# EAGLE design pcbCard (EAGLE 7.4.0)
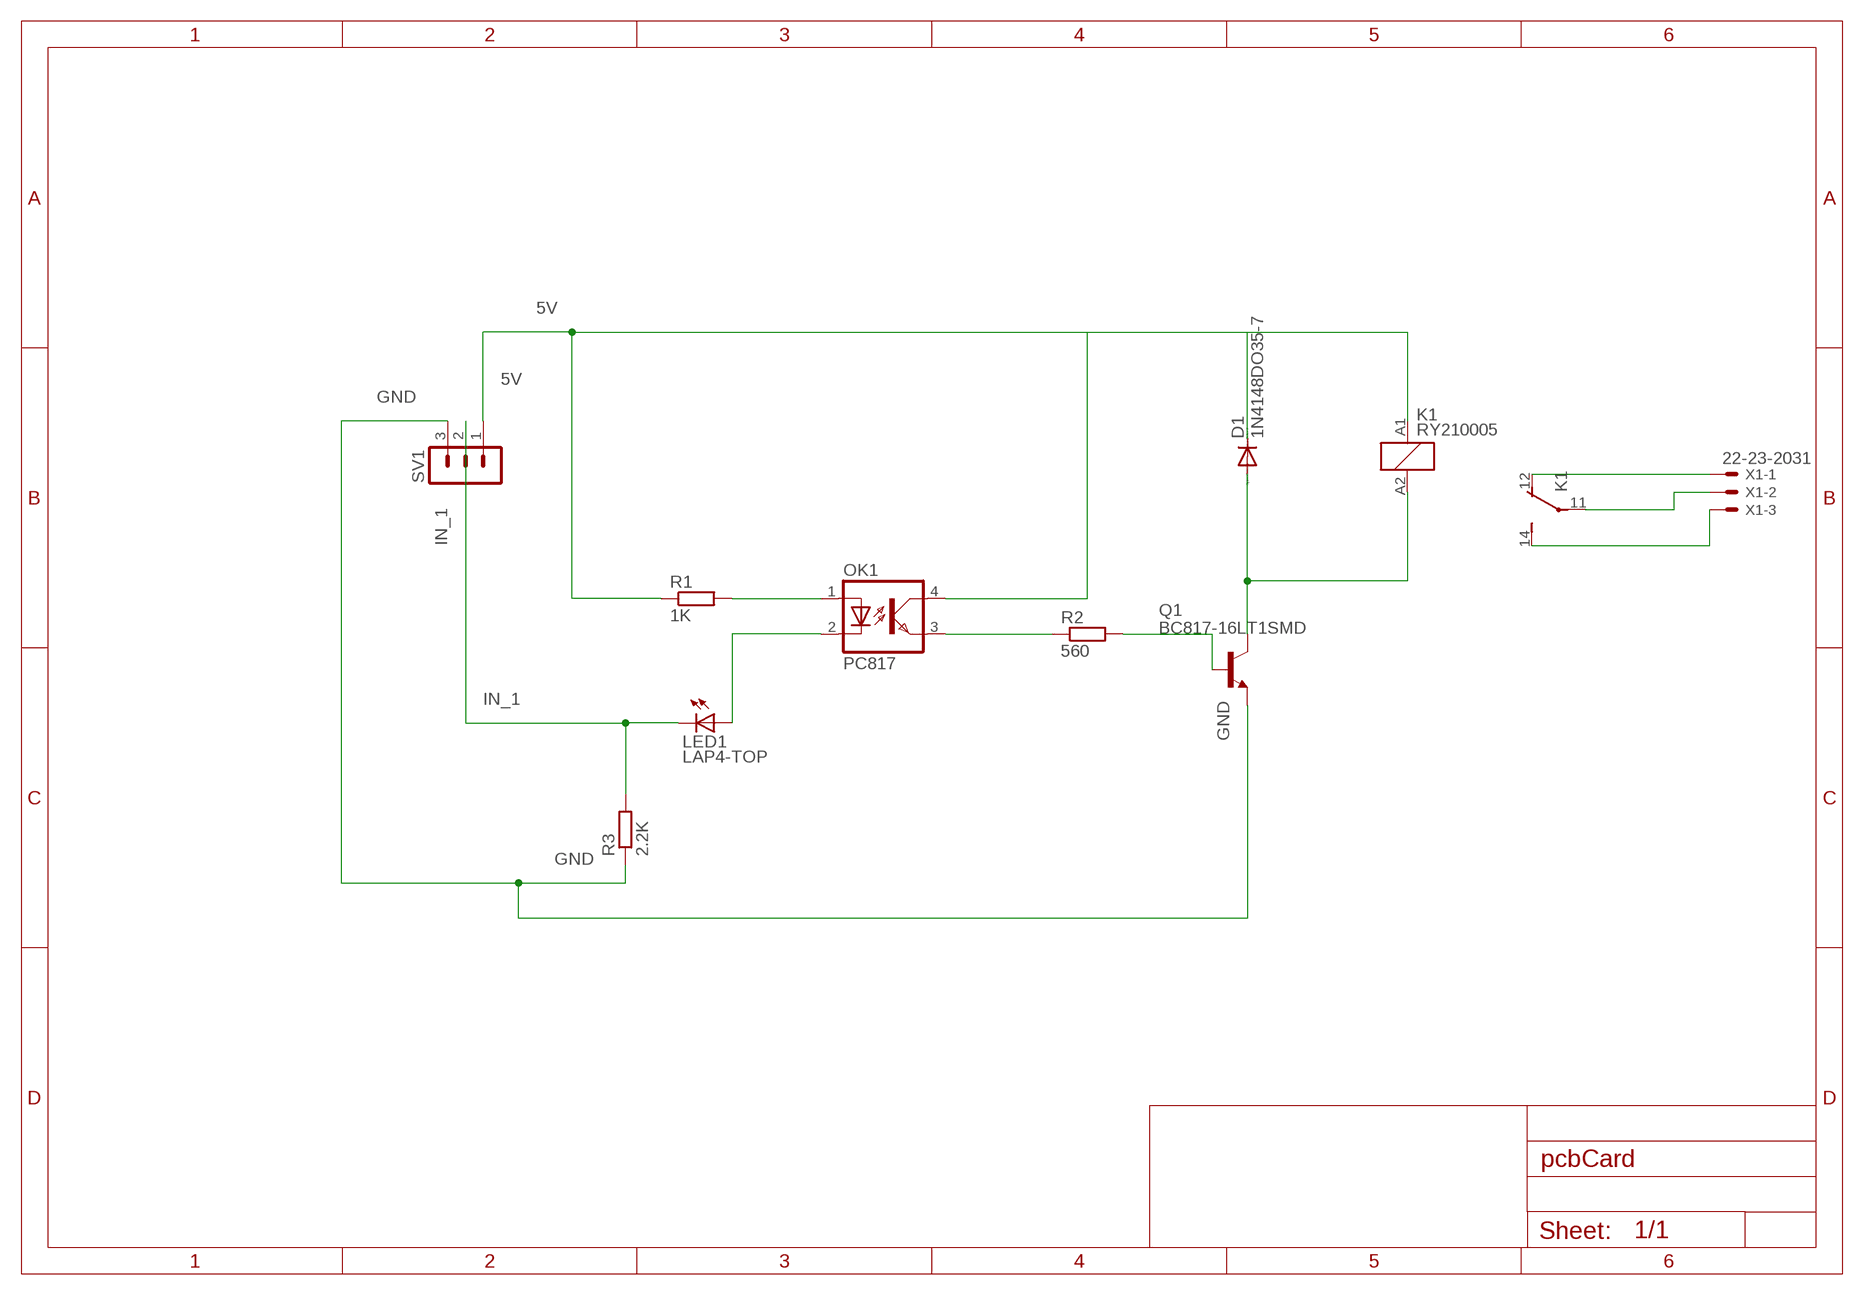
[diagram p0: schematic, sheet 1]

## Parts
D1  1N4148DO35-7  [DO35-7]
K1  RY210005  [RY-II]
LED1  LAP4-TOP  [P47F-TOP]
OK1  PC817  [DIL04]
Q1  BC817-16LT1SMD  [SOT23-BEC]
R1  1K  R-EU_0204/5  [0204/5]
R2  560  R-EU_0204/5  [0204/5]
R3  2.2K  R-EU_0204/5  [0204/5]
SV1  MA03-1  [MA03-1]
X1  22-23-2031  [22-23-2031]

## Nets
N$1: OK1.1(A) R1.2
N$2: D1.A K1.A2 Q1.C
N$3: D1.C K1.A1 OK1.4(COL) R1.1 SV1.1
N$4: OK1.3(EMIT) R2.1
N$5: Q1.B R2.2
N$6: LED1.A OK1.2(C)
N$7: LED1.C R3.2 SV1.2
N$8: Q1.E R3.1 SV1.3
N$10: K1.12(2:O) X1.1
N$11: K1.11(2:P) X1.2
N$12: K1.14(2:S) X1.3

## Notes on the sheet
- 5V
- 5V
- GND
- IN_1
- IN_1
- GND
- GND

## Library data of the parts
D1 = diode:1N4148: DIODE high speed (Philips)
K1 = relay:RY?1*: Miniature Power PCB Relay SCHRACK 1 pole 8 A Source: http://www.schrack.com/.. 5817.pdf; MF: TYCO ELECTRONICS; MPN: RY210005; OC_FARNELL: unknown; OC_NEWARK: 08H3762
LED1 = led:*P4: PointLED® Enhanced Thinfilm LED TOP & BOTTOM mount LS P47F, LR P47F, LA P47F, LY P47F, LT P4SG, LB P4SG, LW P4SG Source: http://catalog.osram-os.com .. LA_LR_LS_LY_P47F_Pb_free.pdf
OK1 = optocoupler:PC817: SHARP OPTO COUPLER; MPN: PC817X4J000F; OC_FARNELL: 9707727; OC_NEWARK: 97K7059
Q1 = transistor-npn:BC817*: NPN Transistor
R1-R3 = rcl:R-EU_: RESISTOR, European symbol
SV1 = con-lstb:MA03-1: PIN HEADER; OC_FARNELL: unknown; OC_NEWARK: unknown
X1 = con-molex:22-23-2031: .100" (2.54mm) Center Header - 3 Pin; MF: MOLEX; MPN: 22-23-2031; OC_FARNELL: 1462950; OC_NEWARK: 30C0862

## Board
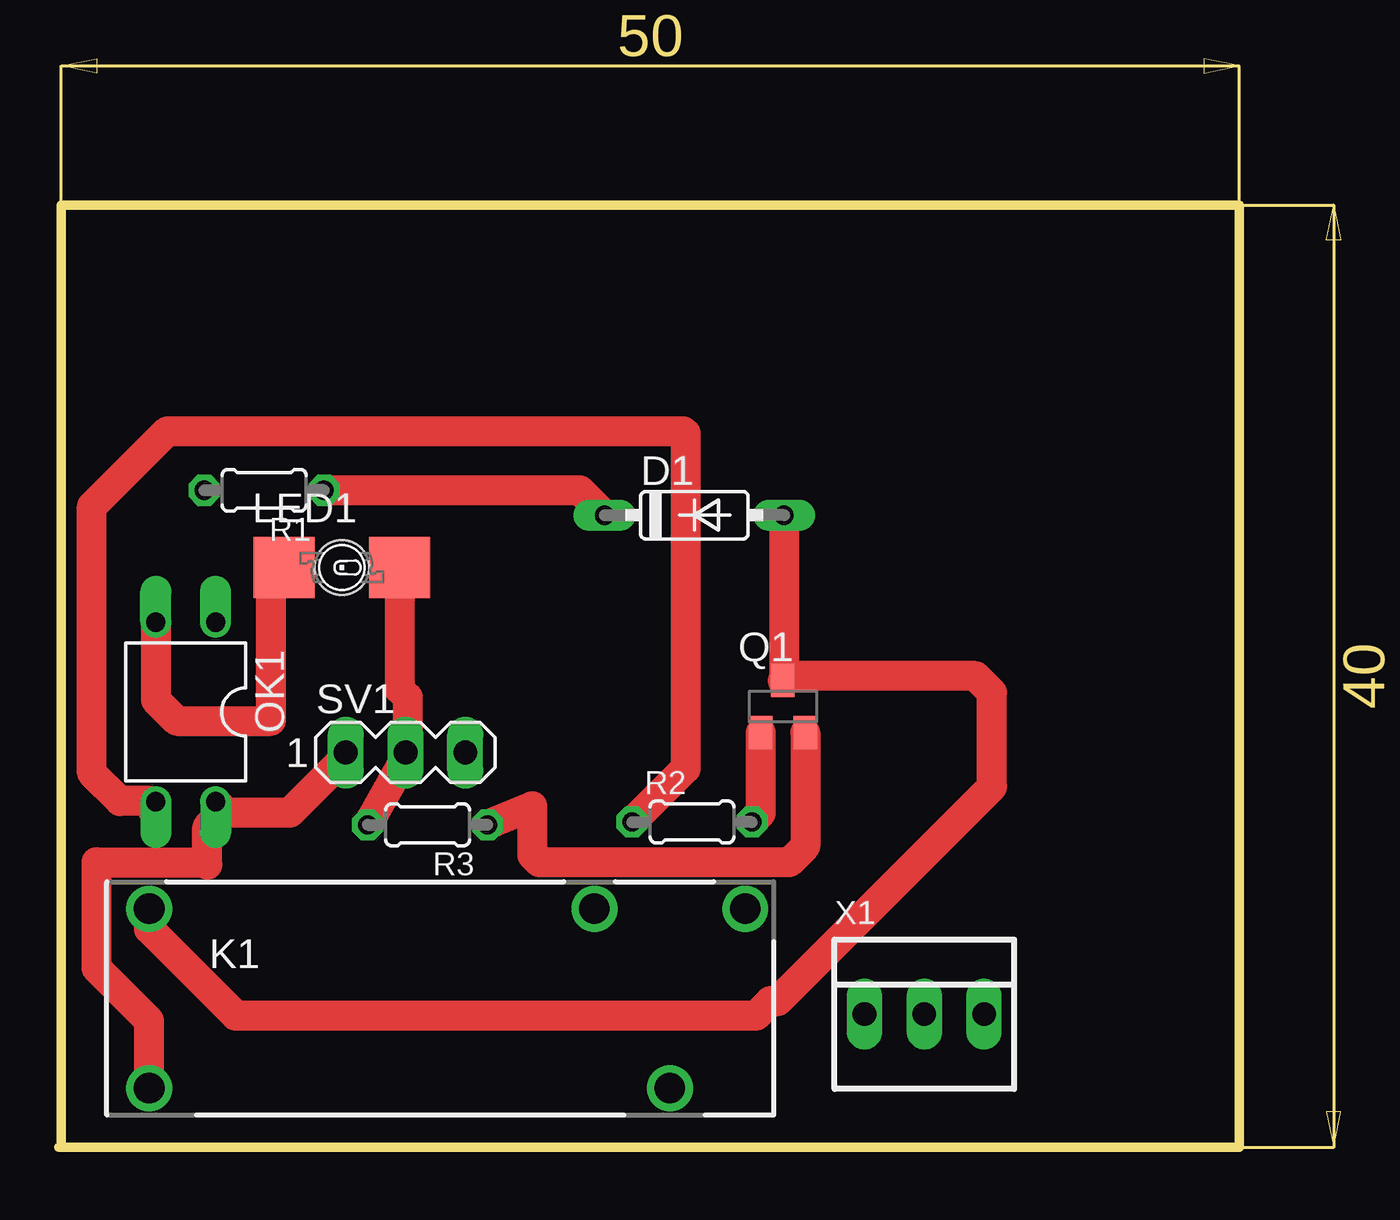
[diagram p1: board, top side]
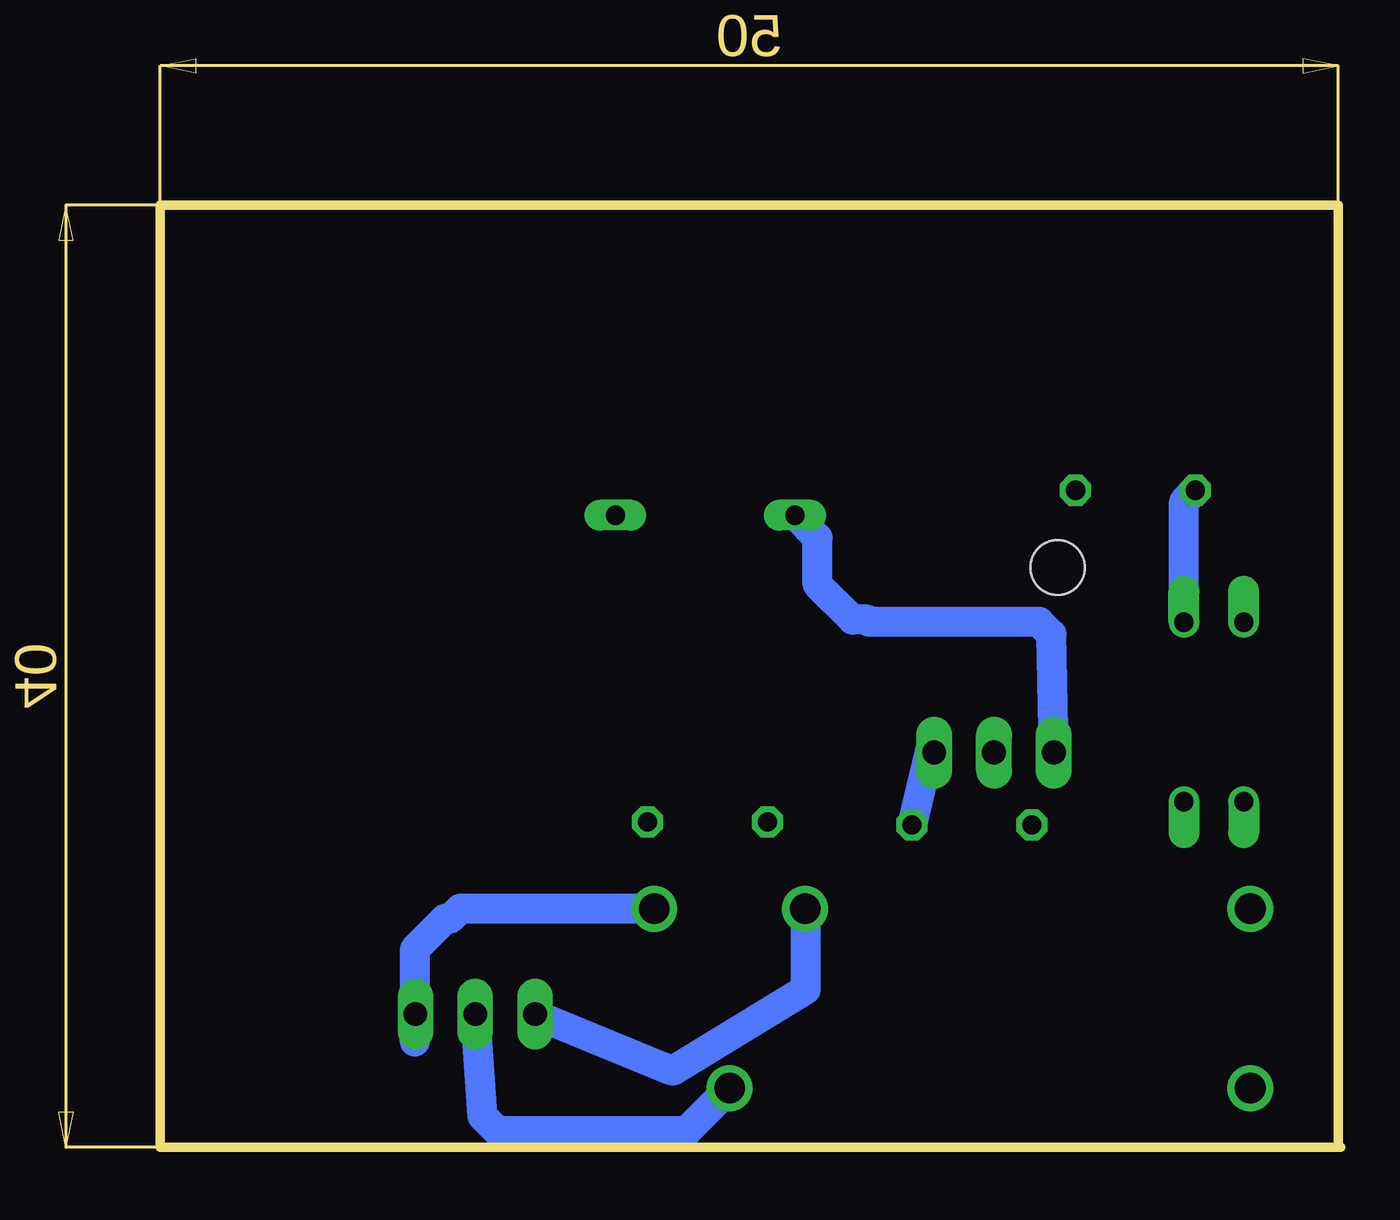
[diagram p2: board, bottom side, seen from below]

Size 50.1 x 40 mm. Coordinates in mm from the lower left corner, seen from the top.
Outline: 0,0 0.1,0
Outline: 0.1,0 0.1,40 50.1,40 50.1,0 0.1,0
Copper layers (1*16): Top 0.035mm / dielectric 1.5mm / Bottom 0.035mm
Design rules "default": minimum track width 10mil, minimum drill 24mil, track to track 8mil, track to pad 8mil, pad to pad 8mil, via to via 8mil, smd to smd 8mil, copper to edge 40mil, drill to drill 8mil, minimum pad ring 10mil, minimum via ring 8mil, stop-mask expansion 4mil, vias tented up to drill 0mil, thermal gap 10mil

### Footprints (pad centres in the part's own frame; a part is rotated, then mirrored left to right if it is on the bottom)
DO35-7 = drill 0.813 long: A 3.81,0; C -3.81,0
RY-II = drill 1.3: 11 9.4,-3.81; 12 6.2,3.81; 14 12.6,3.81; A1 -12.7,-3.81; A2 -12.7,3.81
P47F-TOP = smd 2.6 x 2.6: A -2.45,0; C 2.45,0 | hole 2.3: 0,0
DIL04 = drill 0.813 offset: 1 -1.27,-3.81; 2 1.27,-3.81; 3 1.27,3.81; 4 -1.27,3.81
SOT23-BEC = smd 1 x 1.4: B -0.95,-1.1; C 0,1.1; E 0.95,-1.1
0204/5 = drill 0.813 octagon: 1 -2.54,0; 2 2.54,0
MA03-1 = drill 1.016 long: 1 -2.54,0; 2 0,0; 3 2.54,0
22-23-2031 = drill 1 long: 1 -2.54,0; 2 0,0; 3 2.54,0

### Placement (x,y rotation side)
D1  26.97,26.83 0 top
K1  16.53,6.32 0 top
LED1  12.01,24.61 0 top
OK1  5.38,18.48 180 top
Q1  30.73,18.71 0 top
R1  8.71,27.89 180 top
R2  26.87,13.81 0 top
R3  15.65,13.69 180 top
SV1  14.71,16.76 0 top
X1  36.73,5.65 0 top

### Tracks (layer width: path | path; a pad name or v marks a point on that pad's centre or on a via)
N$1
  Bottom 1.27: OK1.1 6.65,27.41 R1.2
N$2
  Top 1.27: D1.A 30.78,19.86 Q1.C 30.92,20 38.9,20 39.6,19.3 39.6,15.3 30.5,6.2 30.2,6.2 29.6,5.6 7.5,5.6 3.83,9.27 K1.A2
N$3
  Top 1.27: R1.1 22.1,27.89 D1.C | SV1.1 12.27,16.67 9.8,14.2 7.12,14.2 7.01,14.31 | 7.01,14.31 OK1.4 | K1.A1 3.83,5.37 1.6,7.6 1.6,12.1 6.2,12.1 6.3,12 6.3,13.6 7.01,14.31
  Bottom 1.27: SV1.1 12.27,21.77 12.8,22.3 20,22.3 20.1,22.4 20.7,22.4 22.2,23.9 22.2,25.87 D1.C
N$4
  Top 1.27: OK1.3 4.11,14.41 4,14.3 4,14.6 3.9,14.7 2.6,14.7 1.4,15.9 1.4,27.2 4.6,30.4 26.5,30.4 26.6,30.3 26.6,16.08 R2.1
N$5
  Top 1.27: Q1.B 29.78,14.18 R2.2
N$6
  Top 1.27: OK1.2 4.11,18.99 5,18.1 9,18.1 9,24.05 LED1.A
N$7
  Top 1.27: R3.2 14.81,16.69 SV1.2 14.81,16.86 14.81,19.1 14.46,19.45 LED1.C
N$8
  Top 1.27: Q1.E 31.68,12.78 31,12.1 20.4,12.1 20.1,12.4 20.1,14.48 R3.1
  Bottom 1.27: SV1.3 17.35,17.23 R3.1
N$10
  Bottom 1.27: X1.1 28.35,3.25 22.7,6.7 22.7,10.1 K1.12
N$11
  Bottom 1.27: X1.2 36.43,1.33 35.8,0.7 27.74,0.7 K1.11
N$12
  Bottom 1.27: K1.14 37.37,10.13 37.8,9.7 38,9.7 39.3,8.4 39.3,4.48 X1.3